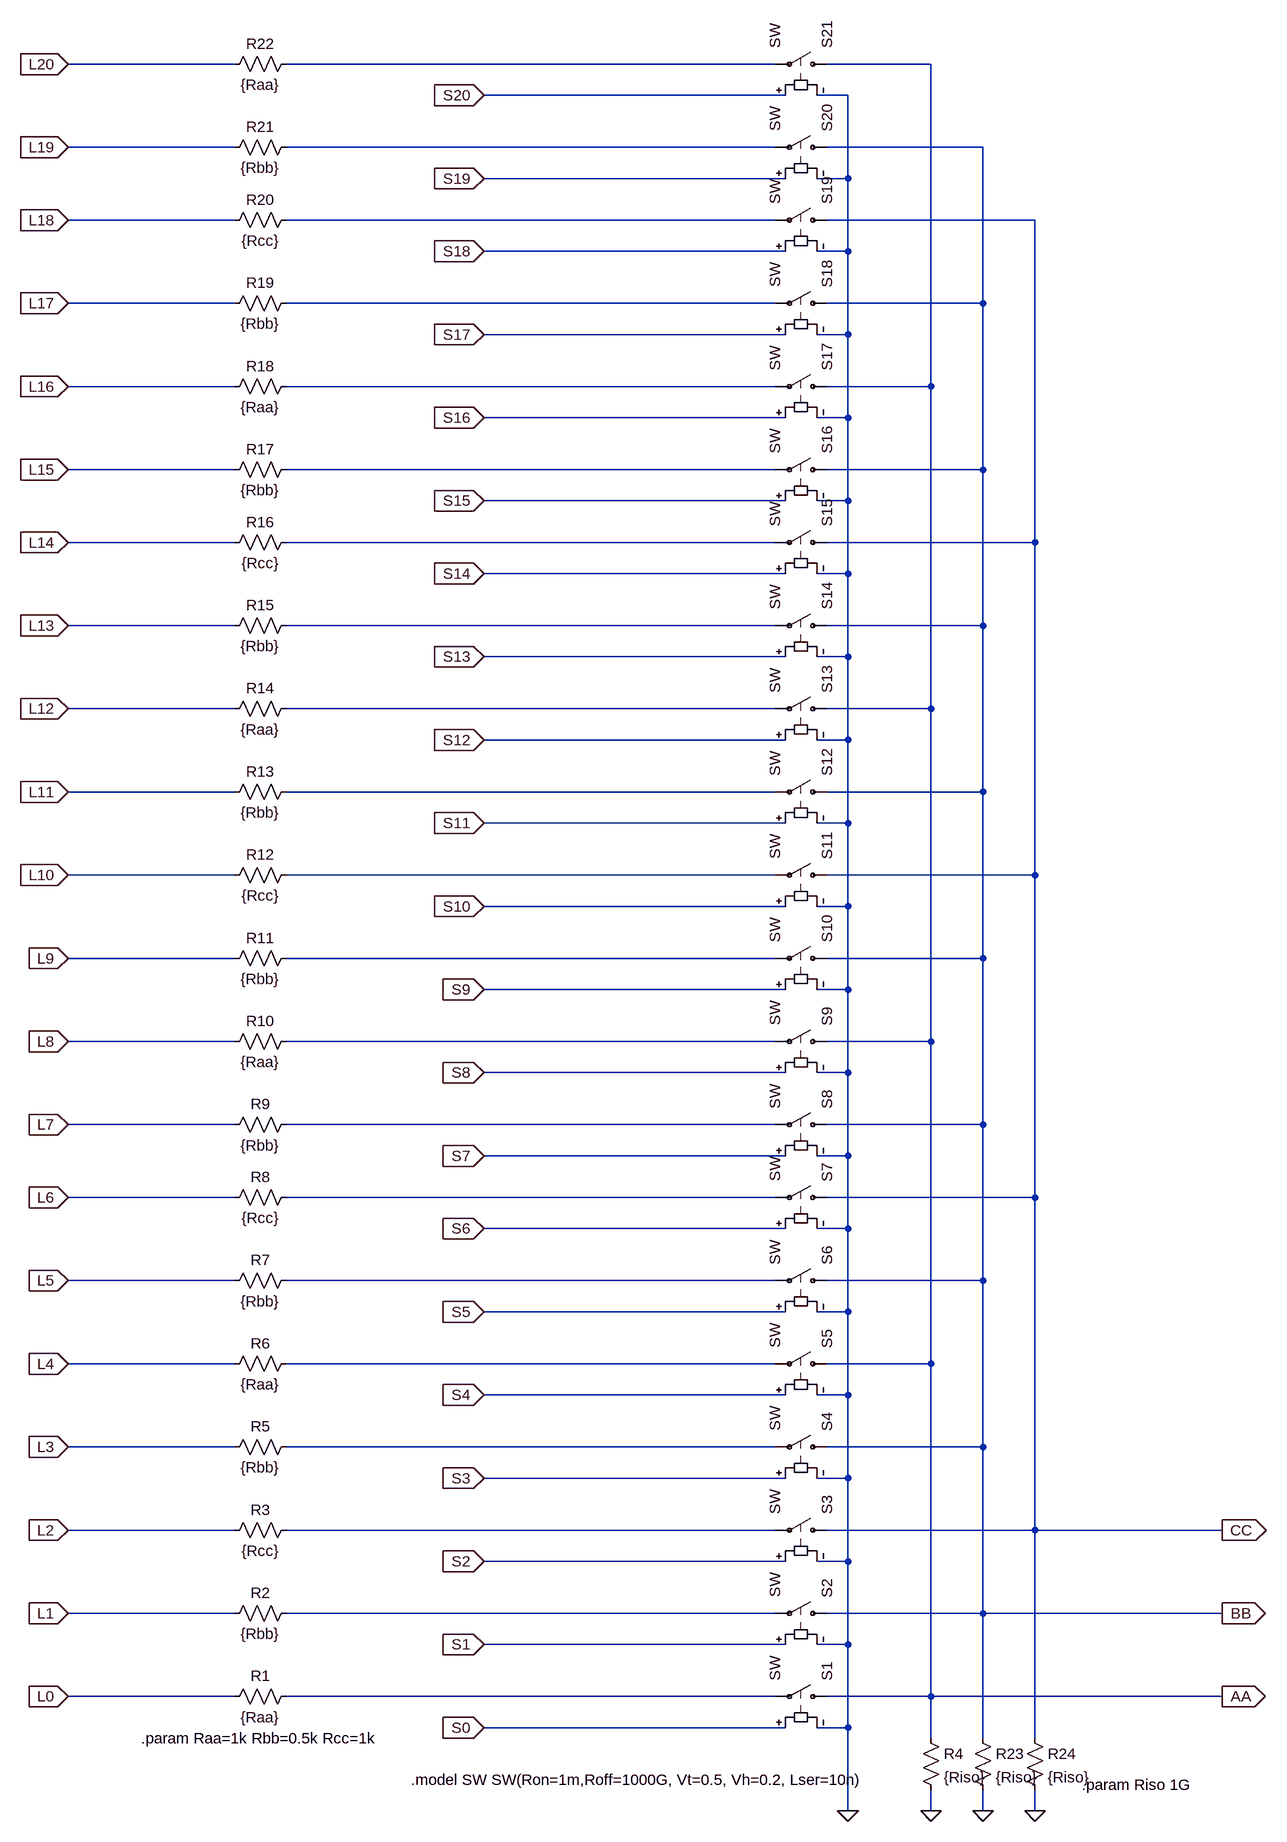
[diagram p0: schematic HighSide.asc]
HighSide.asc, the LTspice schematic file:
Version 4
SHEET 1 892 1160
WIRE -944 -1696 -1200 -1696
WIRE -112 -1696 -864 -1696
WIRE 128 -1696 -32 -1696
WIRE -96 -1648 -560 -1648
WIRE 0 -1648 -48 -1648
WIRE -944 -1568 -1200 -1568
WIRE -112 -1568 -864 -1568
WIRE 208 -1568 -32 -1568
WIRE -96 -1520 -560 -1520
WIRE 0 -1520 0 -1648
WIRE 0 -1520 -48 -1520
WIRE -944 -1456 -1200 -1456
WIRE -112 -1456 -864 -1456
WIRE 288 -1456 -32 -1456
WIRE -96 -1408 -560 -1408
WIRE 0 -1408 0 -1520
WIRE 0 -1408 -48 -1408
WIRE -944 -1328 -1200 -1328
WIRE -112 -1328 -864 -1328
WIRE 208 -1328 208 -1568
WIRE 208 -1328 -32 -1328
WIRE -96 -1280 -560 -1280
WIRE 0 -1280 0 -1408
WIRE 0 -1280 -48 -1280
WIRE -944 -1200 -1200 -1200
WIRE -112 -1200 -864 -1200
WIRE 128 -1200 128 -1696
WIRE 128 -1200 -32 -1200
WIRE -96 -1152 -560 -1152
WIRE 0 -1152 0 -1280
WIRE 0 -1152 -48 -1152
WIRE -944 -1072 -1200 -1072
WIRE -112 -1072 -864 -1072
WIRE 208 -1072 208 -1328
WIRE 208 -1072 -32 -1072
WIRE -96 -1024 -560 -1024
WIRE 0 -1024 0 -1152
WIRE 0 -1024 -48 -1024
WIRE -944 -960 -1200 -960
WIRE -112 -960 -864 -960
WIRE 288 -960 288 -1456
WIRE 288 -960 -32 -960
WIRE -96 -912 -560 -912
WIRE 0 -912 0 -1024
WIRE 0 -912 -48 -912
WIRE -944 -832 -1200 -832
WIRE -112 -832 -864 -832
WIRE 208 -832 208 -1072
WIRE 208 -832 -32 -832
WIRE -96 -784 -560 -784
WIRE 0 -784 0 -912
WIRE 0 -784 -48 -784
WIRE -944 -704 -1200 -704
WIRE -112 -704 -864 -704
WIRE 128 -704 128 -1200
WIRE 128 -704 -32 -704
WIRE -96 -656 -560 -656
WIRE 0 -656 0 -784
WIRE 0 -656 -48 -656
WIRE -944 -576 -1200 -576
WIRE -112 -576 -864 -576
WIRE 208 -576 208 -832
WIRE 208 -576 -32 -576
WIRE -96 -528 -560 -528
WIRE 0 -528 0 -656
WIRE 0 -528 -48 -528
WIRE -944 -448 -1200 -448
WIRE -112 -448 -864 -448
WIRE 288 -448 288 -960
WIRE 288 -448 -32 -448
WIRE -96 -400 -560 -400
WIRE 0 -400 0 -528
WIRE 0 -400 -48 -400
WIRE -944 -320 -1200 -320
WIRE -112 -320 -864 -320
WIRE 208 -320 208 -576
WIRE 208 -320 -32 -320
WIRE -96 -272 -560 -272
WIRE 0 -272 0 -400
WIRE 0 -272 -48 -272
WIRE -944 -192 -1200 -192
WIRE -112 -192 -864 -192
WIRE 128 -192 128 -704
WIRE 128 -192 -32 -192
WIRE -96 -144 -560 -144
WIRE 0 -144 0 -272
WIRE 0 -144 -48 -144
WIRE -944 -64 -1200 -64
WIRE -112 -64 -864 -64
WIRE 208 -64 208 -320
WIRE 208 -64 -32 -64
WIRE -96 -16 -560 -16
WIRE 0 -16 0 -144
WIRE 0 -16 -48 -16
WIRE -944 48 -1200 48
WIRE -112 48 -864 48
WIRE 288 48 288 -448
WIRE 288 48 -32 48
WIRE -96 96 -560 96
WIRE 0 96 0 -16
WIRE 0 96 -48 96
WIRE -944 176 -1200 176
WIRE -112 176 -864 176
WIRE 208 176 208 -64
WIRE 208 176 -32 176
WIRE -96 224 -560 224
WIRE 0 224 0 96
WIRE 0 224 -48 224
WIRE -944 304 -1200 304
WIRE -112 304 -864 304
WIRE 128 304 128 -192
WIRE 128 304 -32 304
WIRE -96 352 -560 352
WIRE 0 352 0 224
WIRE 0 352 -48 352
WIRE -944 432 -1200 432
WIRE -112 432 -864 432
WIRE 208 432 208 176
WIRE 208 432 -32 432
WIRE -96 480 -560 480
WIRE 0 480 0 352
WIRE 0 480 -48 480
WIRE -944 560 -1200 560
WIRE -112 560 -864 560
WIRE 288 560 288 48
WIRE 288 560 -32 560
WIRE 576 560 288 560
WIRE -96 608 -560 608
WIRE 0 608 0 480
WIRE 0 608 -48 608
WIRE -944 688 -1200 688
WIRE -112 688 -864 688
WIRE 208 688 208 432
WIRE 208 688 -32 688
WIRE 576 688 208 688
WIRE -96 736 -560 736
WIRE 0 736 0 608
WIRE 0 736 -48 736
WIRE -944 816 -1200 816
WIRE -112 816 -864 816
WIRE 128 816 128 304
WIRE 128 816 -32 816
WIRE 576 816 128 816
WIRE -96 864 -560 864
WIRE 0 864 0 736
WIRE 0 864 -48 864
WIRE 128 880 128 816
WIRE 208 880 208 688
WIRE 288 880 288 560
WIRE 0 992 0 864
WIRE 128 992 128 960
WIRE 208 992 208 960
WIRE 288 992 288 960
FLAG 0 992 0
FLAG 576 560 CC
IOPIN 576 560 Out
FLAG 576 688 BB
IOPIN 576 688 Out
FLAG 576 816 AA
IOPIN 576 816 Out
FLAG -1200 816 L0
IOPIN -1200 816 In
FLAG -1200 688 L1
IOPIN -1200 688 In
FLAG -1200 560 L2
IOPIN -1200 560 In
FLAG -1200 432 L3
IOPIN -1200 432 In
FLAG -1200 304 L4
IOPIN -1200 304 In
FLAG -1200 176 L5
IOPIN -1200 176 In
FLAG -1200 48 L6
IOPIN -1200 48 In
FLAG -1200 -64 L7
IOPIN -1200 -64 In
FLAG -1200 -192 L8
IOPIN -1200 -192 In
FLAG -1200 -320 L9
IOPIN -1200 -320 In
FLAG -1200 -448 L10
IOPIN -1200 -448 In
FLAG -1200 -576 L11
IOPIN -1200 -576 In
FLAG -1200 -704 L12
IOPIN -1200 -704 In
FLAG -1200 -832 L13
IOPIN -1200 -832 In
FLAG -1200 -960 L14
IOPIN -1200 -960 In
FLAG -1200 -1072 L15
IOPIN -1200 -1072 In
FLAG -1200 -1200 L16
IOPIN -1200 -1200 In
FLAG -1200 -1328 L17
IOPIN -1200 -1328 In
FLAG -1200 -1456 L18
IOPIN -1200 -1456 In
FLAG -1200 -1568 L19
IOPIN -1200 -1568 In
FLAG -1200 -1696 L20
IOPIN -1200 -1696 In
FLAG -560 864 S0
IOPIN -560 864 In
FLAG -560 736 S1
IOPIN -560 736 In
FLAG -560 608 S2
IOPIN -560 608 In
FLAG -560 480 S3
IOPIN -560 480 In
FLAG -560 352 S4
IOPIN -560 352 In
FLAG -560 224 S5
IOPIN -560 224 In
FLAG -560 -272 S9
IOPIN -560 -272 In
FLAG -560 -400 S10
IOPIN -560 -400 In
FLAG -560 -528 S11
IOPIN -560 -528 In
FLAG -560 -656 S12
IOPIN -560 -656 In
FLAG -560 -784 S13
IOPIN -560 -784 In
FLAG -560 -912 S14
IOPIN -560 -912 In
FLAG -560 -1024 S15
IOPIN -560 -1024 In
FLAG -560 -1152 S16
IOPIN -560 -1152 In
FLAG -560 -1280 S17
IOPIN -560 -1280 In
FLAG -560 -1408 S18
IOPIN -560 -1408 In
FLAG -560 -1520 S19
IOPIN -560 -1520 In
FLAG -560 -1648 S20
IOPIN -560 -1648 In
FLAG -560 96 S6
IOPIN -560 96 In
FLAG -560 -16 S7
IOPIN -560 -16 In
FLAG -560 -144 S8
IOPIN -560 -144 In
FLAG 128 992 0
FLAG 208 992 0
FLAG 288 992 0
SYMBOL sw -16 816 M270
SYMATTR InstName S1
SYMBOL sw -16 688 M270
SYMATTR InstName S2
SYMBOL sw -16 560 M270
SYMATTR InstName S3
SYMBOL sw -16 432 M270
SYMATTR InstName S4
SYMBOL sw -16 304 M270
SYMATTR InstName S5
SYMBOL sw -16 176 M270
SYMATTR InstName S6
SYMBOL sw -16 48 M270
SYMATTR InstName S7
SYMBOL sw -16 -64 M270
SYMATTR InstName S8
SYMBOL sw -16 -192 M270
SYMATTR InstName S9
SYMBOL sw -16 -320 M270
SYMATTR InstName S10
SYMBOL sw -16 -448 M270
SYMATTR InstName S11
SYMBOL sw -16 -576 M270
SYMATTR InstName S12
SYMBOL sw -16 -704 M270
SYMATTR InstName S13
SYMBOL sw -16 -832 M270
SYMATTR InstName S14
SYMBOL sw -16 -960 M270
SYMATTR InstName S15
SYMBOL sw -16 -1072 M270
SYMATTR InstName S16
SYMBOL sw -16 -1200 M270
SYMATTR InstName S17
SYMBOL sw -16 -1328 M270
SYMATTR InstName S18
SYMBOL sw -16 -1456 M270
SYMATTR InstName S19
SYMBOL sw -16 -1568 M270
SYMATTR InstName S20
SYMBOL sw -16 -1696 M270
SYMATTR InstName S21
SYMBOL res -848 800 R90
WINDOW 0 0 56 VBottom 2
WINDOW 3 32 56 VTop 2
SYMATTR InstName R1
SYMATTR Value {Raa}
SYMBOL res -848 672 R90
WINDOW 0 0 56 VBottom 2
WINDOW 3 32 56 VTop 2
SYMATTR InstName R2
SYMATTR Value {Rbb}
SYMBOL res -848 544 R90
WINDOW 0 0 56 VBottom 2
WINDOW 3 32 56 VTop 2
SYMATTR InstName R3
SYMATTR Value {Rcc}
SYMBOL res -848 416 R90
WINDOW 0 0 56 VBottom 2
WINDOW 3 32 56 VTop 2
SYMATTR InstName R5
SYMATTR Value {Rbb}
SYMBOL res -848 288 R90
WINDOW 0 0 56 VBottom 2
WINDOW 3 32 56 VTop 2
SYMATTR InstName R6
SYMATTR Value {Raa}
SYMBOL res -848 160 R90
WINDOW 0 0 56 VBottom 2
WINDOW 3 32 56 VTop 2
SYMATTR InstName R7
SYMATTR Value {Rbb}
SYMBOL res -848 32 R90
WINDOW 0 0 56 VBottom 2
WINDOW 3 32 56 VTop 2
SYMATTR InstName R8
SYMATTR Value {Rcc}
SYMBOL res -848 -80 R90
WINDOW 0 0 56 VBottom 2
WINDOW 3 32 56 VTop 2
SYMATTR InstName R9
SYMATTR Value {Rbb}
SYMBOL res -848 -208 R90
WINDOW 0 0 56 VBottom 2
WINDOW 3 32 56 VTop 2
SYMATTR InstName R10
SYMATTR Value {Raa}
SYMBOL res -848 -336 R90
WINDOW 0 0 56 VBottom 2
WINDOW 3 32 56 VTop 2
SYMATTR InstName R11
SYMATTR Value {Rbb}
SYMBOL res -848 -464 R90
WINDOW 0 0 56 VBottom 2
WINDOW 3 32 56 VTop 2
SYMATTR InstName R12
SYMATTR Value {Rcc}
SYMBOL res -848 -592 R90
WINDOW 0 0 56 VBottom 2
WINDOW 3 32 56 VTop 2
SYMATTR InstName R13
SYMATTR Value {Rbb}
SYMBOL res -848 -720 R90
WINDOW 0 0 56 VBottom 2
WINDOW 3 32 56 VTop 2
SYMATTR InstName R14
SYMATTR Value {Raa}
SYMBOL res -848 -848 R90
WINDOW 0 0 56 VBottom 2
WINDOW 3 32 56 VTop 2
SYMATTR InstName R15
SYMATTR Value {Rbb}
SYMBOL res -848 -976 R90
WINDOW 0 0 56 VBottom 2
WINDOW 3 32 56 VTop 2
SYMATTR InstName R16
SYMATTR Value {Rcc}
SYMBOL res -848 -1088 R90
WINDOW 0 0 56 VBottom 2
WINDOW 3 32 56 VTop 2
SYMATTR InstName R17
SYMATTR Value {Rbb}
SYMBOL res -848 -1216 R90
WINDOW 0 0 56 VBottom 2
WINDOW 3 32 56 VTop 2
SYMATTR InstName R18
SYMATTR Value {Raa}
SYMBOL res -848 -1344 R90
WINDOW 0 0 56 VBottom 2
WINDOW 3 32 56 VTop 2
SYMATTR InstName R19
SYMATTR Value {Rbb}
SYMBOL res -848 -1472 R90
WINDOW 0 0 56 VBottom 2
WINDOW 3 32 56 VTop 2
SYMATTR InstName R20
SYMATTR Value {Rcc}
SYMBOL res -848 -1584 R90
WINDOW 0 0 56 VBottom 2
WINDOW 3 32 56 VTop 2
SYMATTR InstName R21
SYMATTR Value {Rbb}
SYMBOL res -848 -1712 R90
WINDOW 0 0 56 VBottom 2
WINDOW 3 32 56 VTop 2
SYMATTR InstName R22
SYMATTR Value {Raa}
SYMBOL res 112 864 R0
SYMATTR InstName R4
SYMATTR Value {Riso}
SYMBOL res 192 864 R0
SYMATTR InstName R23
SYMATTR Value {Riso}
SYMBOL res 272 864 R0
SYMATTR InstName R24
SYMATTR Value {Riso}
TEXT -1088 880 Left 2 !.param Raa=1k Rbb=0.5k Rcc=1k
TEXT -672 944 Left 2 !.model SW SW(Ron=1m,Roff=1000G, Vt=0.5, Vh=0.2, Lser=10n)
TEXT 360 952 Left 2 !.param Riso 1G

The netlist it stands for:
* HighSide.asc
S1 AA N021 S0 0 SW
S2 BB N020 S1 0 SW
S3 CC N019 S2 0 SW
S4 BB N018 S3 0 SW
S5 AA N017 S4 0 SW
S6 BB N016 S5 0 SW
S7 CC N015 S6 0 SW
S8 BB N014 S7 0 SW
S9 AA N013 S8 0 SW
S10 BB N012 S9 0 SW
S11 CC N011 S10 0 SW
S12 BB N010 S11 0 SW
S13 AA N009 S12 0 SW
S14 BB N008 S13 0 SW
S15 CC N007 S14 0 SW
S16 BB N006 S15 0 SW
S17 AA N005 S16 0 SW
S18 BB N004 S17 0 SW
S19 CC N003 S18 0 SW
S20 BB N002 S19 0 SW
S21 AA N001 S20 0 SW
R1 N021 L0 {Raa}
R2 N020 L1 {Rbb}
R3 N019 L2 {Rcc}
R5 N018 L3 {Rbb}
R6 N017 L4 {Raa}
R7 N016 L5 {Rbb}
R8 N015 L6 {Rcc}
R9 N014 L7 {Rbb}
R10 N013 L8 {Raa}
R11 N012 L9 {Rbb}
R12 N011 L10 {Rcc}
R13 N010 L11 {Rbb}
R14 N009 L12 {Raa}
R15 N008 L13 {Rbb}
R16 N007 L14 {Rcc}
R17 N006 L15 {Rbb}
R18 N005 L16 {Raa}
R19 N004 L17 {Rbb}
R20 N003 L18 {Rcc}
R21 N002 L19 {Rbb}
R22 N001 L20 {Raa}
R4 AA 0 {Riso}
R23 BB 0 {Riso}
R24 CC 0 {Riso}
.param Raa=1k Rbb=0.5k Rcc=1k
.model SW SW(Ron=1m,Roff=1000G, Vt=0.5, Vh=0.2, Lser=10n)
.param Riso 1G
.backanno
.end